# Altium schematic sheet Relay_Control.SchDoc
size A; SheetNumber: 2; SheetTotal: 5
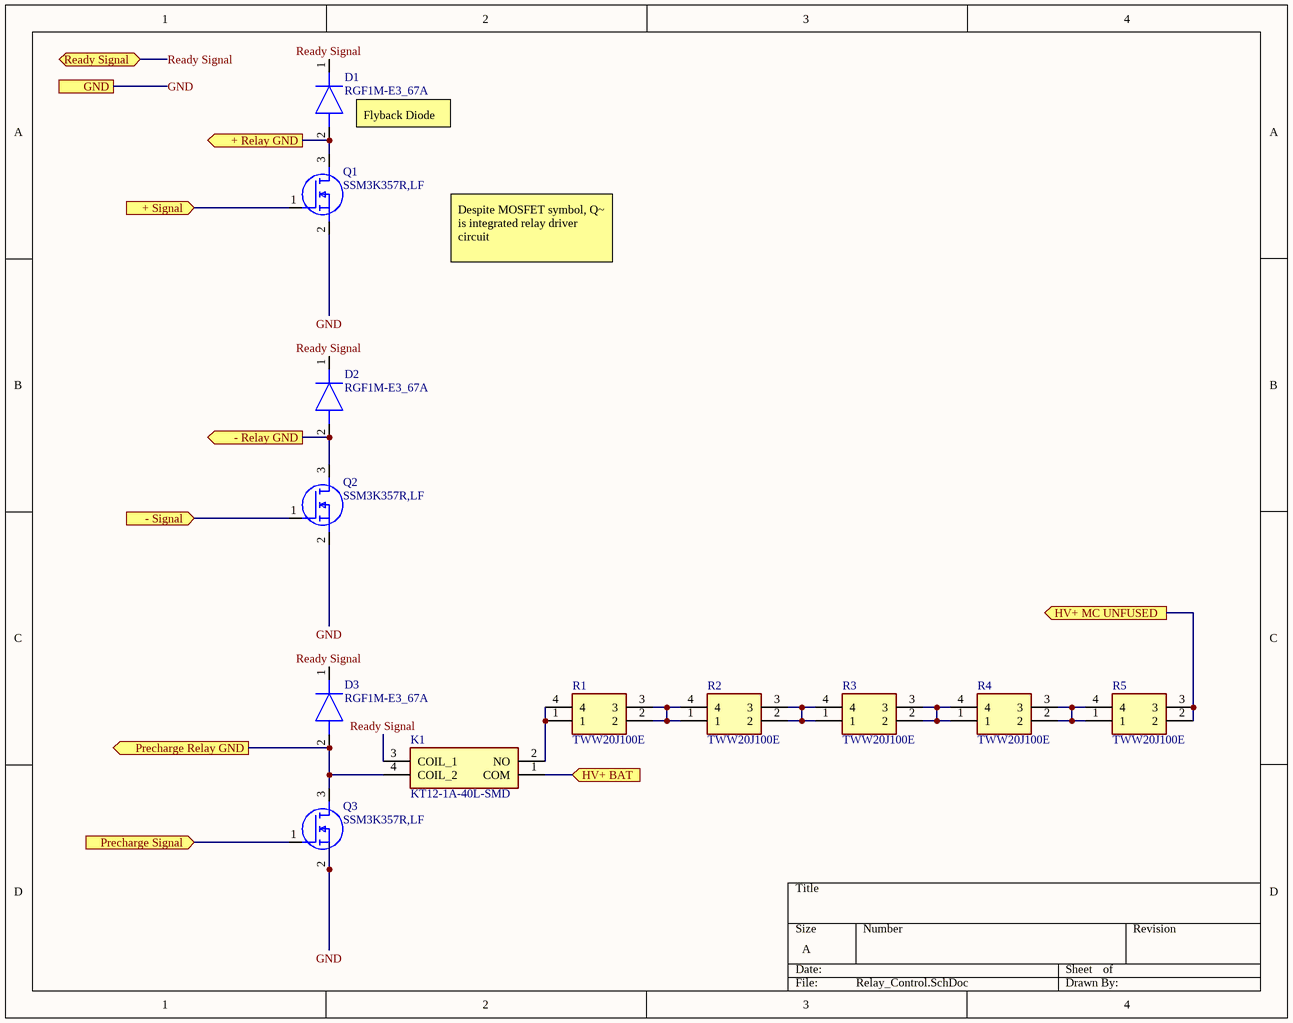
[diagram p0: Relay_Control.SchDoc]

## Parts
D1  RGF1M-E3_67A  [DIOM5426X300N]
D2  RGF1M-E3_67A  [DIOM5426X300N]
D3  RGF1M-E3_67A  [DIOM5426X300N]
K1  KT12-1A-40L-SMD  [KT121A40LSMD]
Q1  SSM3K357R,LF  [SOTFL95P240X88-3N]
Q2  SSM3K357R,LF  [SOTFL95P240X88-3N]
Q3  SSM3K357R,LF  [SOTFL95P240X88-3N]
R1  TWW20J100E  [TWW20J100E]
R2  TWW20J100E  [TWW20J100E]
R3  TWW20J100E  [TWW20J100E]
R4  TWW20J100E  [TWW20J100E]
R5  TWW20J100E  [TWW20J100E]

## Ports
+ Relay GND (out), + Signal (in), - Relay GND (out), - Signal (in), GND, HV+ BAT (in), HV+ MC UNFUSED (out), Precharge Relay GND (out), Precharge Signal (in), Ready Signal (bidir)

## Nets
+ Relay GND: D1.2(A) Q1.3(D) ; port + Relay GND
+ Signal: Q1.1(G) ; port + Signal
- Relay GND: D2.2(A) Q2.3(D) ; port - Relay GND
- Signal: Q2.1(G) ; port - Signal
GND: Q1.2(S) Q2.2(S) Q3.2(S) ; port GND
HV+ BAT: K1.1(COM) ; port HV+ BAT
HV+ MC UNFUSED: R5.2 R5.3 ; port HV+ MC UNFUSED
Precharge Relay GND: D3.2(A) K1.4(COIL_2) Q3.3(D) ; port Precharge Relay GND
Precharge Signal: Q3.1(G) ; port Precharge Signal
Ready Signal: D1.1(K) D2.1(K) D3.1(K) K1.3(COIL_1) ; port Ready Signal
NetK1_2: K1.2(NO) R1.1 R1.4
NetR1_2: R1.2 R1.3 R2.1 R2.4
NetR2_2: R2.2 R2.3 R3.1 R3.4
NetR3_2: R3.2 R3.3 R4.1 R4.4
NetR4_2: R4.2 R4.3 R5.1 R5.4

## Notes on the sheet
- (near D1) Flyback Diode
- Despite MOSFET symbol, Q~ is integrated relay driver circuit

## Library data of the parts
D1-D3 = RGF1M-E3_67A: Diode; Manufacturer_Name: Vishay; Manufacturer_Part_Number: RGF1M-E3/67A; Datasheet Link: https://www.vishay.com/docs/88697/rgf1.pdf; Height: 3mm; Mouser Part Number: 625-RGF1M-E3; Mouser Price/Stock: https://www.mouser.co.uk/ProductDetail/Vishay-General-Semiconductor/RGF1M-E3-67A?qs=4xyK702%2F%252BQ1dl%252BTCdyIThg%3D%3D; Arrow Part Number: RGF1M-E3/67A; Arrow Price/Stock: https://www.arrow.com/en/products/rgf1m-e367a/vishay?region=nac
K1 = KT12-1A-40L-SMD: Relay or Contactor; Manufacturer_Name: STANDEXMEDER; Datasheet Link: https://standexelectronics.com/resources/technical-library/technical-papers/datasheet-kt-series-reed-relay/; Height: 8.7mm; Manufacturer_Part_Number: KT12-1A-40L-SMD; Mouser Part Number: 876-KT12-1A-40L-SMD; Arrow Part Number: KT12-1A-40L-SMD; Arrow Price/Stock: https://www.arrow.com/en/products/kt12-1a-40l-smd/standex-meder-electronics
Q1-Q3 = SSM3K357R,LF: MOSFET (N-Channel); Manufacturer_Name: Toshiba; Datasheet Link: https://toshiba.semicon-storage.com/info/docget.jsp?did=59207&prodName=SSM3K357R; Height: 0.88mm; Manufacturer_Part_Number: SSM3K357R,LF; Mouser Part Number: 757-SSM3K357RLF; Mouser Price/Stock: https://www.mouser.co.uk/ProductDetail/Toshiba/SSM3K357RLF?qs=F5EMLAvA7ICLn4Y138U4bA%3D%3D; Arrow Part Number: SSM3K357R,LF; Arrow Price/Stock: https://www.arrow.com/en/products/ssm3k357rlf/toshiba?utm_currency=USD&region=nac
R1-R5 = TWW20J100E: Resistor; Manufacturer_Name: Ohmite; Datasheet Link: https://www.mouser.in/datasheet/2/303/res_tww_twm-1228653.pdf; Height: 46mm; Manufacturer_Part_Number: TWW20J100E; Mouser Part Number: 588-TWW20J100E; Mouser Price/Stock: https://www.mouser.co.uk/ProductDetail/Ohmite/TWW20J100E?qs=PzGy0jfpSMsE3rbWfgqD2A%3D%3D